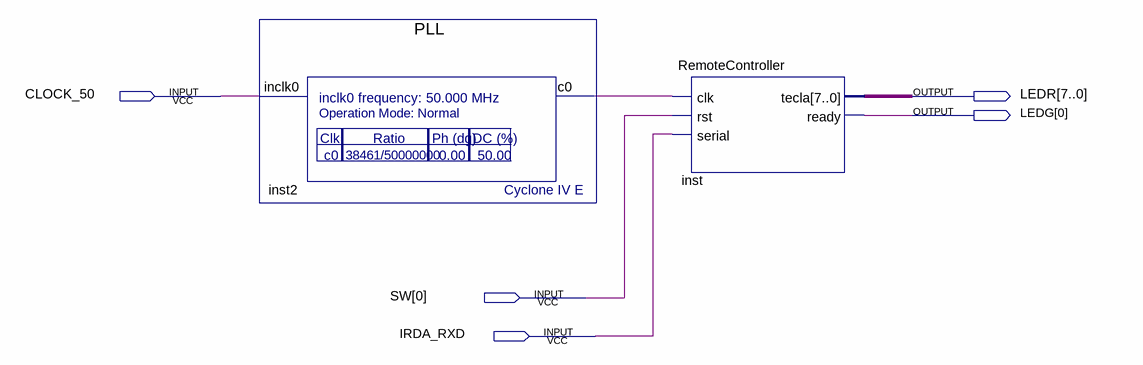
[diagram p0: schematic sheet]
// Quartus schematic RemoteDiagrama.bdf as structural Verilog: 2 symbols, 5 pins
module RemoteDiagrama (
  input  CLOCK_50,
  input  [0:0] SW,
  input  IRDA_RXD,
  output [7:0] LEDR,
  output [0:0] LEDG
);

  wire inst2_c0;

  PLL inst2 (.inclk0(CLOCK_50), .c0(inst2_c0));
  RemoteController inst (.clk(inst2_c0), .rst(SW[0]), .serial(IRDA_RXD), .tecla(LEDR), .ready(LEDG[0]));
endmodule
